# EAGLE design untitled (EAGLE 9.0.1)
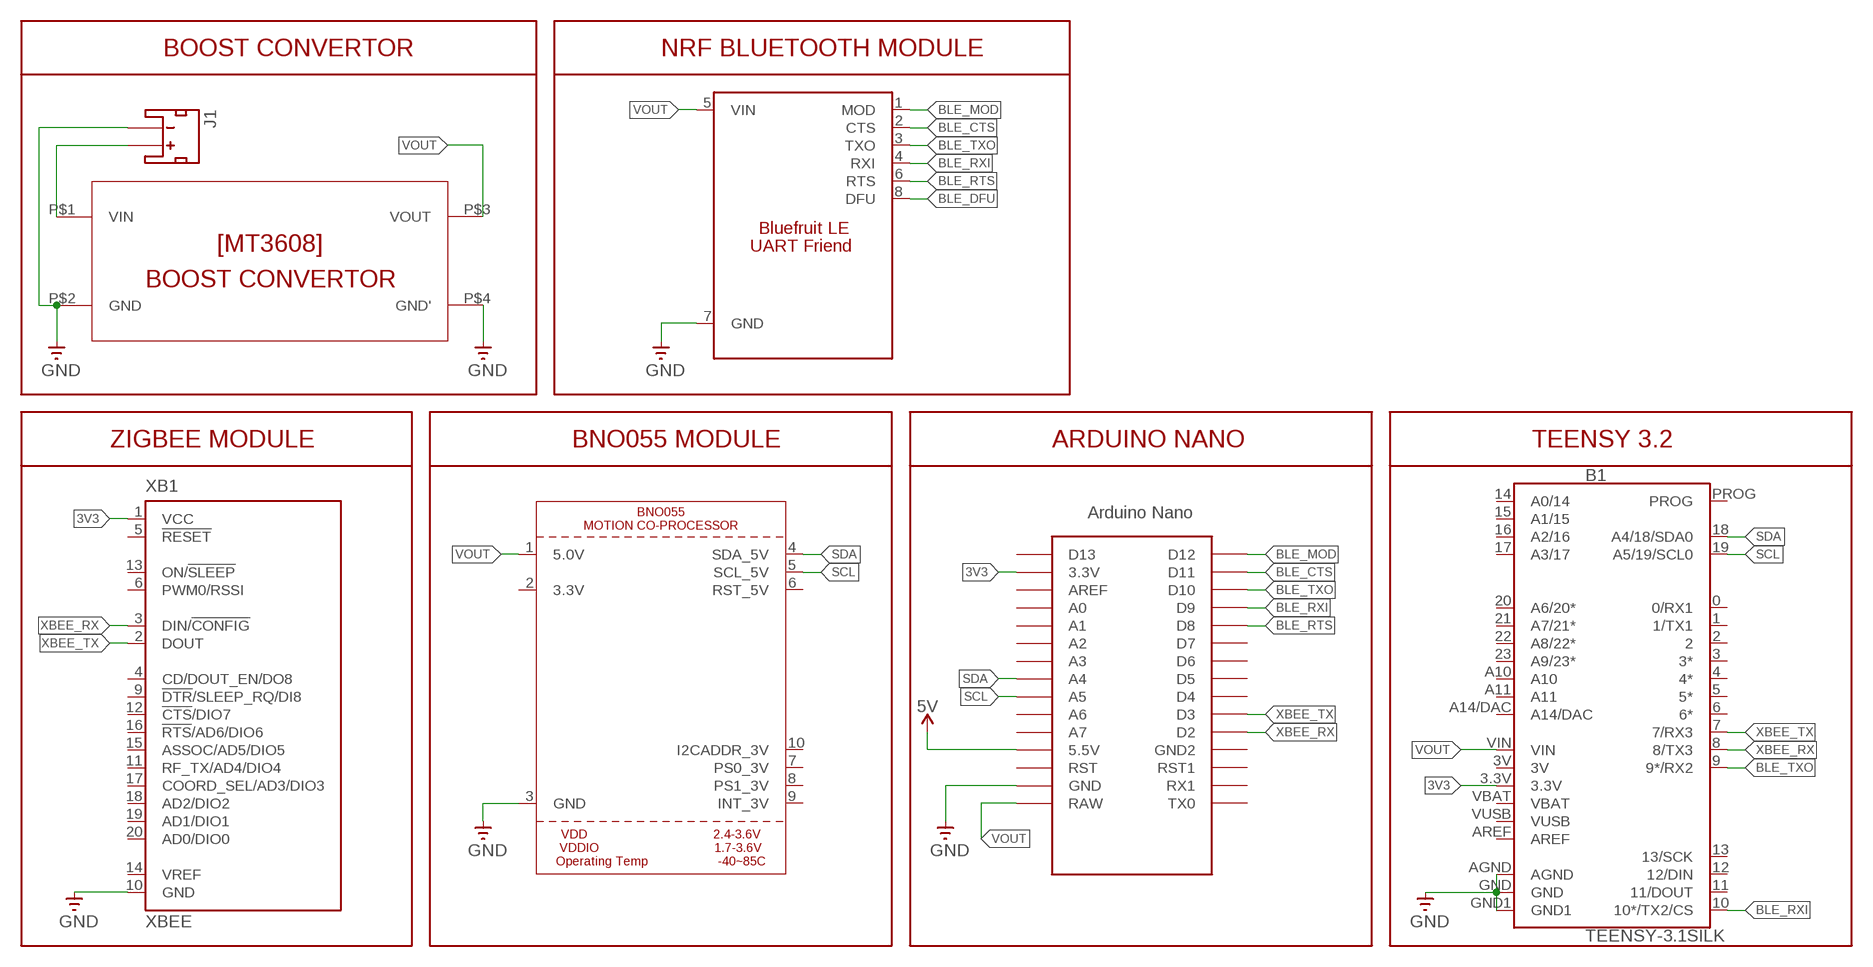
[diagram p0: schematic, sheet 1]

## Parts
B1  TEENSY-3.1SILK  [TEENSY-3.1]
J1  JST_2MM_MALE  [JST-2-SMD]
U$1  NANO  [NANO]
U$2  BNO055  [BNO]
U$3  MT3608  [MT3608]
U$4  BLUEFRUIT_LE  [BLUETOOTH_FRIEND]
XB1  XBEE  [XBEE]

## Nets
3V3: B1.3.3V U$1.3.3V XB1.1(VCC)
5V: U$1.5V(5.5V)
BLE_CTS: U$1.D11 U$4.2(CTS)
BLE_DFU: U$4.8(DFU)
BLE_MOD: U$1.D12 U$4.1(MOD)
BLE_RTS: U$1.D8 U$4.6(RTS)
BLE_RXI: B1.10(10*/TX2/CS) U$1.D9 U$4.4(RXI)
BLE_TXO: B1.9(9*/RX2) U$1.D10 U$4.3(TXO)
GND: B1.AGND B1.GND B1.GND1 J1.1(-) U$1.GND U$2.3(GND) U$3.P$2(GND) U$3.P$4(GND') U$4.7(GND) XB1.10(GND)
N$1: J1.2(+) U$3.P$1(VIN)
SCL: B1.19(A5/19/SCL0) U$1.A5 U$2.5(SCL_5V)
SDA: B1.18(A4/18/SDA0) U$1.A4 U$2.4(SDA_5V)
VOUT: B1.VIN U$1.RAW U$2.1(5.0V) U$3.P$3(VOUT) U$4.5(VIN)
XBEE_RX: B1.8(8/TX3) U$1.D2 XB1.3(DIN/!CONFIG)
XBEE_TX: B1.7(7/RX3) U$1.D3 XB1.2(DOUT)
Unconnected: B1.0(0/RX1) B1.1(1/TX1) B1.2 B1.3(3*) B1.4(4*) B1.5(5*) B1.6(6*) B1.11(11/DOUT) B1.12(12/DIN) B1.13(13/SCK) B1.14(A0/14) B1.15(A1/15) B1.16(A2/16) B1.17(A3/17) B1.20(A6/20*) B1.21(A7/21*) B1.22(A8/22*) B1.23(A9/23*) B1.A10 B1.A11 B1.A14/DAC B1.AREF B1.PROG J1.NC1(PAD1) J1.NC2(PAD2) U$1.A0 U$1.A1 U$1.A2 U$1.A3 U$1.A6 U$1.A7 U$1.AREF U$1.D4 U$1.D5 U$1.D6 U$1.D7 U$1.D13 U$1.GND1(GND2) U$1.ICSP1 U$1.ICSP2 U$1.ICSP3 U$1.ICSP4 U$1.ICSP5 U$1.ICSP6 U$1.RST U$1.RST1 U$1.RX1 U$1.TX0 U$2.2(3.3V) U$2.6(RST_5V) U$2.7(PS0_3V) U$2.8(PS1_3V) U$2.9(INT_3V) U$2.10(I2CADDR_3V) XB1.4(CD/DOUT_EN/DO8) XB1.5(!RESET) XB1.6(PWM0/RSSI) XB1.9(!DTR!/SLEEP_RQ/DI8) XB1.11(RF_TX/AD4/DIO4) XB1.12(!CTS!/DIO7) XB1.13(ON/!SLEEP) XB1.14(VREF) XB1.15(ASSOC/AD5/DIO5) XB1.16(!RTS!/AD6/DIO6) XB1.17(COORD_SEL/AD3/DIO3) XB1.18(AD2/DIO2) XB1.19(AD1/DIO1) XB1.20(AD0/DIO0)

## Notes on the sheet
- BOOST CONVERTOR | NRF BLUETOOTH MODULE
- ZIGBEE MODULE | BNO055 MODULE | ARDUINO NANO | TEENSY 3.2

## Power pins joined to a net without a drawn wire
3V: B1.3V
VBAT: B1.VBAT
VUSB: B1.VUSB

## Library data of the parts
B1 = SparkFun-Boards:TEENSY-3.1: Teensy 3+ Footprint Mechanical footprint with connectors for Teensy Development Board with ARM Cortex. SparkFun Products: Teensy 3.2 <https://www.sparkfun.com/products/13736> Teensy LC <https://www.sparkfun.com/products/13305>; SF_ID: DEV-12646
J1 = SparkFun-Connectors:JST_2MM_MALE: JST 2MM MALE RA CONNECTOR Two pin, compact surface mount connector. Commonly used as a battery input connection point. We really like the solid locking feeling and high current rating on these small connectors. We use these all the time as battery connectors. Mates to single-cell LiPo batteries. Here is the connector we sell at SparkFun: JST Right Angle Connector - White <https://www.sparkfun.com/products/8612> (PRT-08612) Datasheet <http://www.sparkfun.com/datasheets/Prototyping/Connectors/JST-Horizontal.pdf> It was used on these SparkFun products: SparkFun MOSFET Power Controller <https://www.sparkfun.com/products/11214> (PRT-11214) SparkFun Battery Babysitter - LiPo Battery Manager <https://www.sparkfun.com/products/13777> (PRT-13777) And many, many others that required a lipo battery connection.; PROD_ID: CONN-11443; SF_ID: PRT-08612
U$1 = Arduino-clone:NANO: Arduino Nano
U$2 = BNO055:BNO055
U$3 = MT3608:MT3608
U$4 = untitled:BLUEFRUIT_LE
XB1 = microbuilder:XBEE: XBee (TM) /XBee-PRO(TM) OEM RF Modules Source: MaxStream, Inc. xbee_productmanual.pdf

## Board
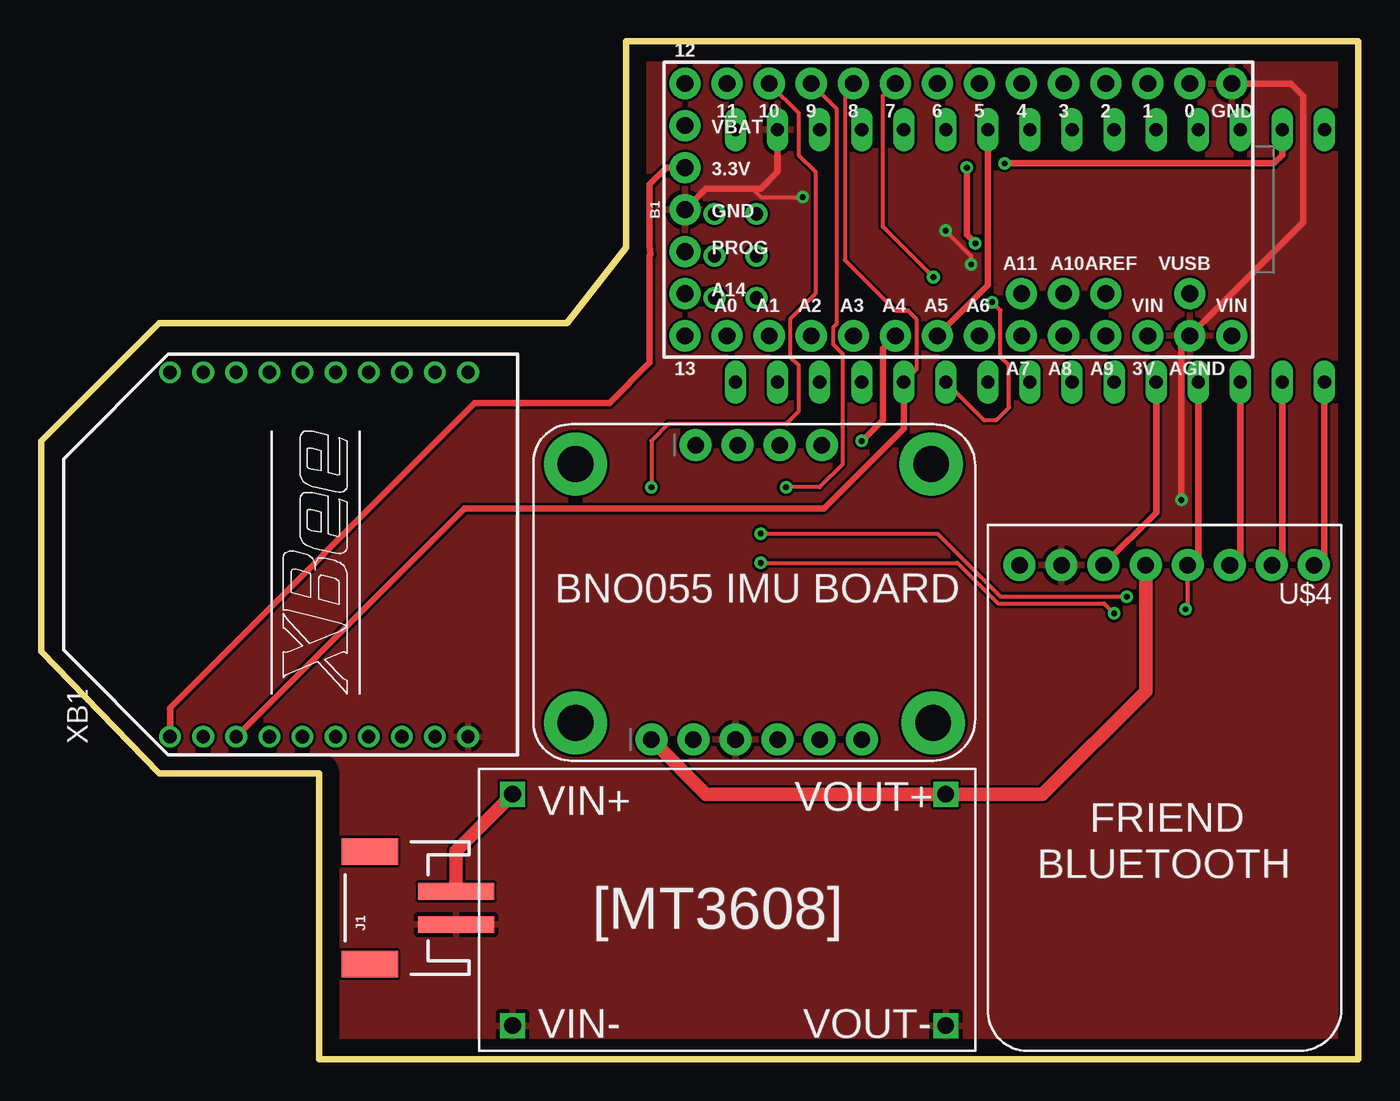
[diagram p1: board, top side]
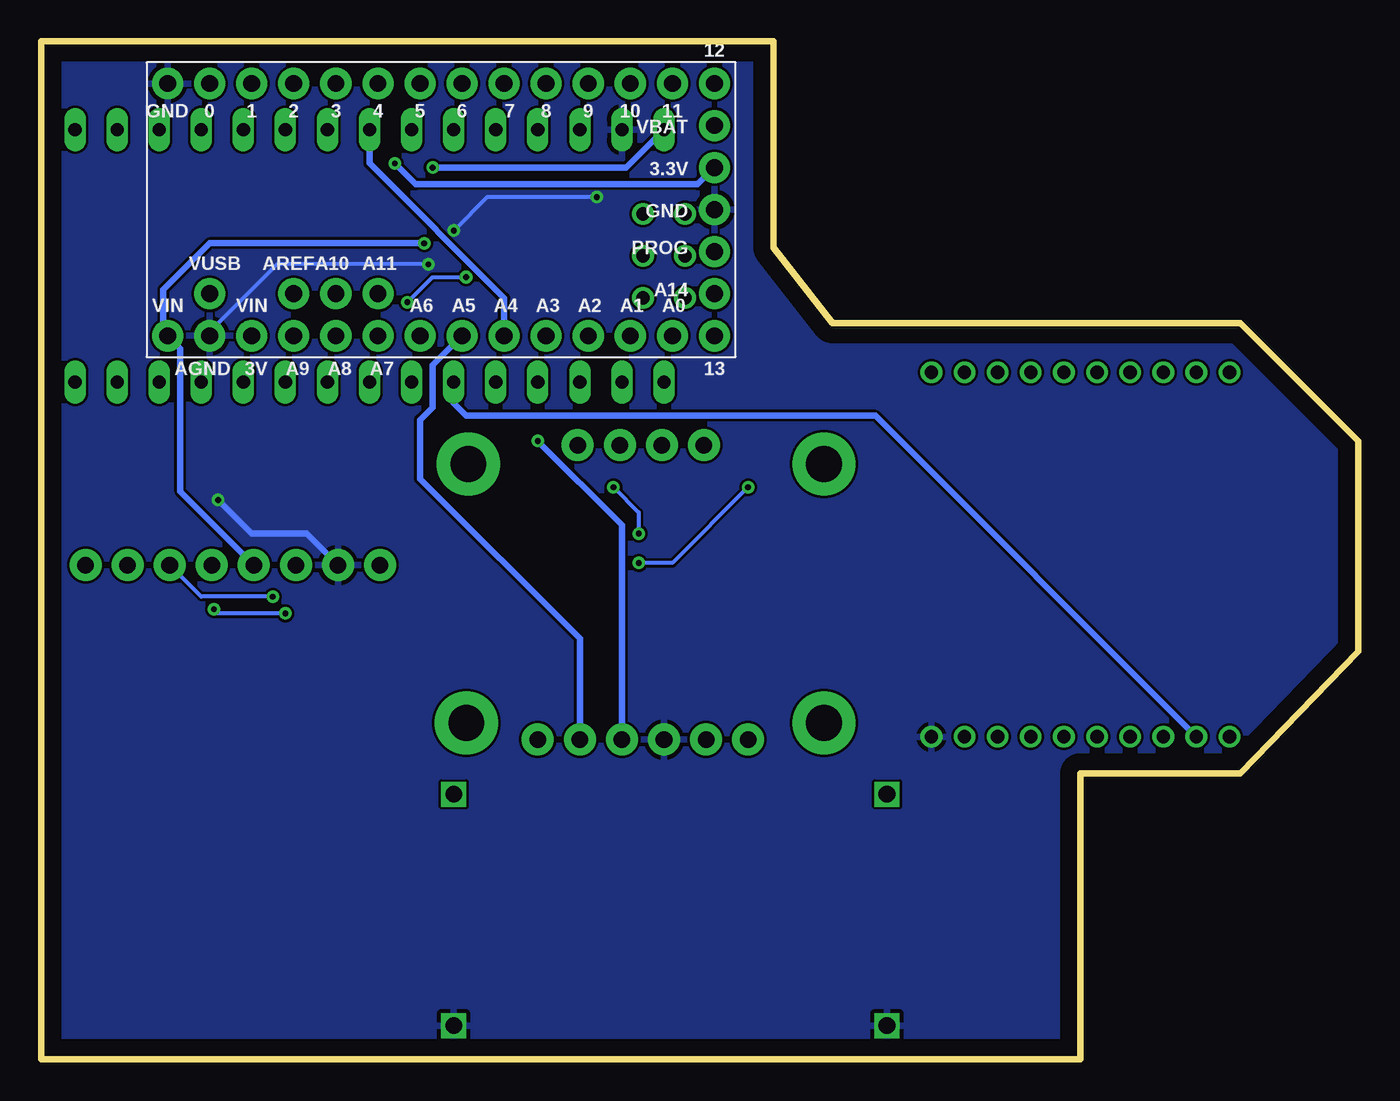
[diagram p2: board, bottom side, seen from below]

Size 79.5 x 61.47 mm. Coordinates in mm from the lower left corner, seen from the top.
Outline: 0,24.64 0,37.34 7.11,44.45 31.75,44.45 35.31,49.02 35.31,61.47 79.5,61.47 79.5,0 16.76,0 16.76,17.27 7.11,17.27 0,24.64
Copper layers (1*16): Top 0.035mm / dielectric 1.5mm / Bottom 0.035mm
Design rules "default": minimum track width 6mil, minimum drill 0.35mm, track to track 6mil, track to pad 6mil, pad to pad 6mil, via to via 6mil, smd to smd 6mil, copper to edge 40mil, drill to drill 6mil, minimum pad ring 10mil, minimum via ring 8mil, stop-mask expansion 4mil, vias tented up to drill 0mil, thermal gap 10mil

### Footprints (pad centres in the part's own frame; a part is rotated, then mirrored left to right if it is on the bottom)
TEENSY-3.1 = drill 1.016 pad 1.88: 0 7.62,-13.97; 1 7.62,-11.43; 2 7.62,-8.89; 3 7.62,-6.35; 3.3V 2.54,16.51; 3V -7.62,-11.43; 4 7.62,-3.81; 5 7.62,-1.27; 6 7.62,1.27; 7 7.62,3.81; 8 7.62,6.35; 9 7.62,8.89; 10 7.62,11.43; 11 7.62,13.97; 12 7.62,16.51; 13 -7.62,16.51; 14 -7.62,13.97; 15 -7.62,11.43; 16 -7.62,8.89; 17 -7.62,6.35; 18 -7.62,3.81; 19 -7.62,1.27; 20 -7.62,-1.27; 21 -7.62,-3.81; 22 -7.62,-6.35; 23 -7.62,-8.89; A10 -5.08,-6.35; A11 -5.08,-3.81; A14/DAC -5.08,16.51; AGND -7.62,-13.97; AREF -5.08,-8.89; GND 0,16.51; GND1 7.62,-16.51; PROG -2.54,16.51; VBAT 5.08,16.51; VIN -7.62,-16.51; VUSB -5.08,-13.97
JST-2-SMD = smd 1 x 4.6: 1 -1,-3.7; 2 1,-3.7 | smd 1.6 x 3.4: NC1 -3.4,1.5; NC2 3.4,1.5
NANO = drill 0.8 long: 3.3V -10.16,24.13; 5V -10.16,-1.27; A0 -10.16,19.05; A1 -10.16,16.51; A2 -10.16,13.97; A3 -10.16,11.43; A4 -10.16,8.89; A5 -10.16,6.35; A6 -10.16,3.81; A7 -10.16,1.27; AREF -10.16,21.59; D2 5.08,1.27; D3 5.08,3.81; D4 5.08,6.35; D5 5.08,8.89; D6 5.08,11.43; D7 5.08,13.97; D8 5.08,16.51; D9 5.08,19.05; D10 5.08,21.59; D11 5.08,24.13; D12 5.08,26.67; D13 -10.16,26.67; GND -10.16,-6.35; GND1 5.08,-1.27; RAW -10.16,-8.89; RST -10.16,-3.81; RST1 5.08,-3.81; RX1 5.08,-6.35; TX0 5.08,-8.89 | drill 0.8: ICSP1 -5.08,-10.16; ICSP2 -5.08,-7.62; ICSP3 -2.54,-10.16; ICSP4 -2.54,-7.62; ICSP5 0,-10.16; ICSP6 0,-7.62
BNO = drill 1 pad 1.93: 1 7.62,1.524; 2 10.16,1.524; 3 12.7,1.524; 4 15.24,1.524; 5 17.78,1.524; 6 20.32,1.524; 7 10.287,19.304; 8 12.827,19.304; 9 15.367,19.304; 10 17.907,19.304 | drill 2.159 pad 3.81: P$1 3.048,18.161; P$2 24.511,18.161; P$3 24.638,2.54; P$5 3.048,2.54
MT3608 = drill 1 square: P$1 2.032,15.494; P$2 2.032,1.524; P$3 28.194,15.494; P$4 28.194,1.524
BLUETOOTH_FRIEND = drill 1 pad 1.93: 1 1.651,2.413; 2 4.191,2.413; 3 6.731,2.413; 4 9.271,2.413; 5 11.811,2.413; 6 14.351,2.413; 7 16.891,2.413; 8 19.431,2.413
XBEE = drill 0.8 pad 1.27: 1 -11,9; 2 -11,7; 3 -11,5; 4 -11,3; 5 -11,1; 6 -11,-1; 7 -11,-3; 8 -11,-5; 9 -11,-7; 10 -11,-9; 11 11,-9; 12 11,-7; 13 11,-5; 14 11,-3; 15 11,-1; 16 11,1; 17 11,3; 18 11,5; 19 11,7; 20 11,9

### Placement (x,y rotation side)
B1  55.37,51.31 90 top
J1  21.34,9.14 90 top
U$1  50.8,45.97 270 top
U$2  29.21,17.78 0 top
U$3  26.42,0.51 0 top
U$4  78.49,32.26 180 top
XB1  16.76,30.48 90 top

### Tracks (layer width: path | path; a pad name or v marks a point on that pad's centre or on a via)
3V3  (via drill 0.35)
  Top 0.406: XB1.1 7.76,21.23 26.16,39.62 34.29,39.62 36.73,42.06 36.73,48.53 36.79,48.61 36.73,49.11 36.73,52.83 37.74,53.85 B1.3.3V | v58.17,54.1 74.42,54.1 74.93,54.61 U$1.3.3V
  Bottom 0.406: B1.3.3V 39.88,52.83 56.9,52.83 v58.17,54.1
BLE_CTS
  Top 0.406: U$4.2 74.93,30.48 U$1.D11
BLE_MOD
  Top 0.406: U$4.1 77.47,30.48 U$1.D12
BLE_RTS
  Top 0.406: U$4.6 67.31,33.02 U$1.D8
BLE_RXI  (via drill 0.35)
  Top 0.254: B1.10 45.72,57.15 45.72,54.61 46.74,53.59 46.74,46.23 45.21,44.7 45.21,42.42 45.72,41.91 45.72,39.12 44.96,38.35 37.85,38.35 36.83,37.34 v36.83,34.54 | v43.43,29.97 55.3,29.97 57.74,27.53 64.16,27.53 v64.77,26.92 | v69.09,27.18 69.22,27.3 U$4.4
  Top 0.406: U$4.4 69.85,30.48 U$1.D9
  Bottom 0.254: v36.83,34.54 41.4,29.97 v43.43,29.97 | v64.77,26.92 68.83,26.92 v69.09,27.18
BLE_TXO  (via drill 0.35)
  Top 0.254: B1.9 48.01,57.4 48.01,44.4 47.8,44.19 47.8,43.18 48.36,42.62 48.36,35.92 46.99,34.54 v44.96,34.54 | v43.43,31.75 54.1,31.75 57.91,27.94 v65.53,27.94
  Top 0.406: U$4.3 72.39,30.48 U$1.D10
  Bottom 0.254: v44.96,34.54 43.43,33.02 v43.43,31.75 | v65.53,27.94 69.85,27.94 U$4.3
GND  (via drill 0.35)
  Top 0.254: 42.93,52.58 43.43,52.07 v45.97,52.07 | v54.6,50.05 56.13,48.51 v56.13,48.01
  Top 0.406: B1.GND1 75.44,58.93 76.2,58.17 76.2,50.55 B1.AGND 68.83,43.18 v68.83,33.78 | B1.GND 40.13,52.58 42.93,52.58 43.43,52.58 44.45,53.59 U$1.GND
  Bottom 0.254: v45.97,52.07 52.58,52.07 v54.6,50.05 | v56.13,48.01 65.28,48.01 69.34,43.94 B1.AGND
  Bottom 0.406: v68.83,33.78 66.8,31.75 63.5,31.75 U$4.7
  pour Top: -3.3,65.02 -3.3,-3.56 16.76,-3.56 85.09,-3.56 85.09,58.93 85.09,65.02
  pour Bottom: -5.33,64.77 -5.33,-3.81 82.55,-3.81 82.55,64.77
N$1
  Top 0.813: J1.2 25.04,12.59 U$3.P$1
SCL
  Top 0.406: B1.19 57.15,46.74 U$1.A5
  Bottom 0.406: U$2.5 46.99,25.4 56.64,35.05 56.64,38.61 55.88,39.37 55.88,41.91 B1.19
SDA  (via drill 0.35)
  Top 0.406: v49.53,37.34 50.8,38.61 50.8,42.93 B1.18
  Bottom 0.406: U$2.4 44.45,32.26 v49.53,37.34 | B1.18 51.56,45.97 59.69,54.1 U$1.A4
VOUT  (via drill 0.35)
  Top 0.406: v55.88,53.85 55.88,49.78 v56.39,49.28
  Top 0.813: U$2.1 40.13,16 U$3.P$3 60.45,16 66.68,22.22 U$4.5
  Bottom 0.406: U$4.5 71.12,34.29 71.12,42.93 B1.VIN 72.14,43.94 72.14,46.48 69.34,49.28 v56.39,49.28 | U$1.RAW 44.2,53.85 v55.88,53.85
XBEE_RX
  Top 0.254: B1.8 48.51,58.42 48.51,48.26 51.56,45.21 52.32,45.21 52.83,44.7 52.83,41.66 U$1.D2
  Top 0.406: XB1.3 25.56,33.27 47.24,33.27 52.07,38.1 U$1.D2
XBEE_TX  (via drill 0.35)
  Top 0.254: U$1.D3 56.9,38.61 57.66,38.61 58.42,39.37 58.42,41.91 57.91,42.42 57.91,45.21 v57.4,45.72 | v53.86,47.23 50.8,50.29 50.8,58.17 B1.7
  Bottom 0.254: v57.4,45.72 55.89,47.23 v53.86,47.23
  Bottom 0.406: XB1.2 29.15,38.86 53.85,38.86 54.61,39.62 U$1.D3